# Altium schematic sheet CuC_DataComm.SchDoc: CuC Data Comm
size A4; Author: eldar6776@hotmail.com; DrawnBy: Eldar Dedić; Organization: PROVEN d.o.o.; Address1: Adema Buće 102; Address2: 71000 Sarajevo; Address3: Federacija BiH; Address4: Bosna i Hercegovina; DocumentNumber: DE211213; Revision: 001; SheetNumber: 8; SheetTotal: 15; ProjectName: MIKSER SIROVINE
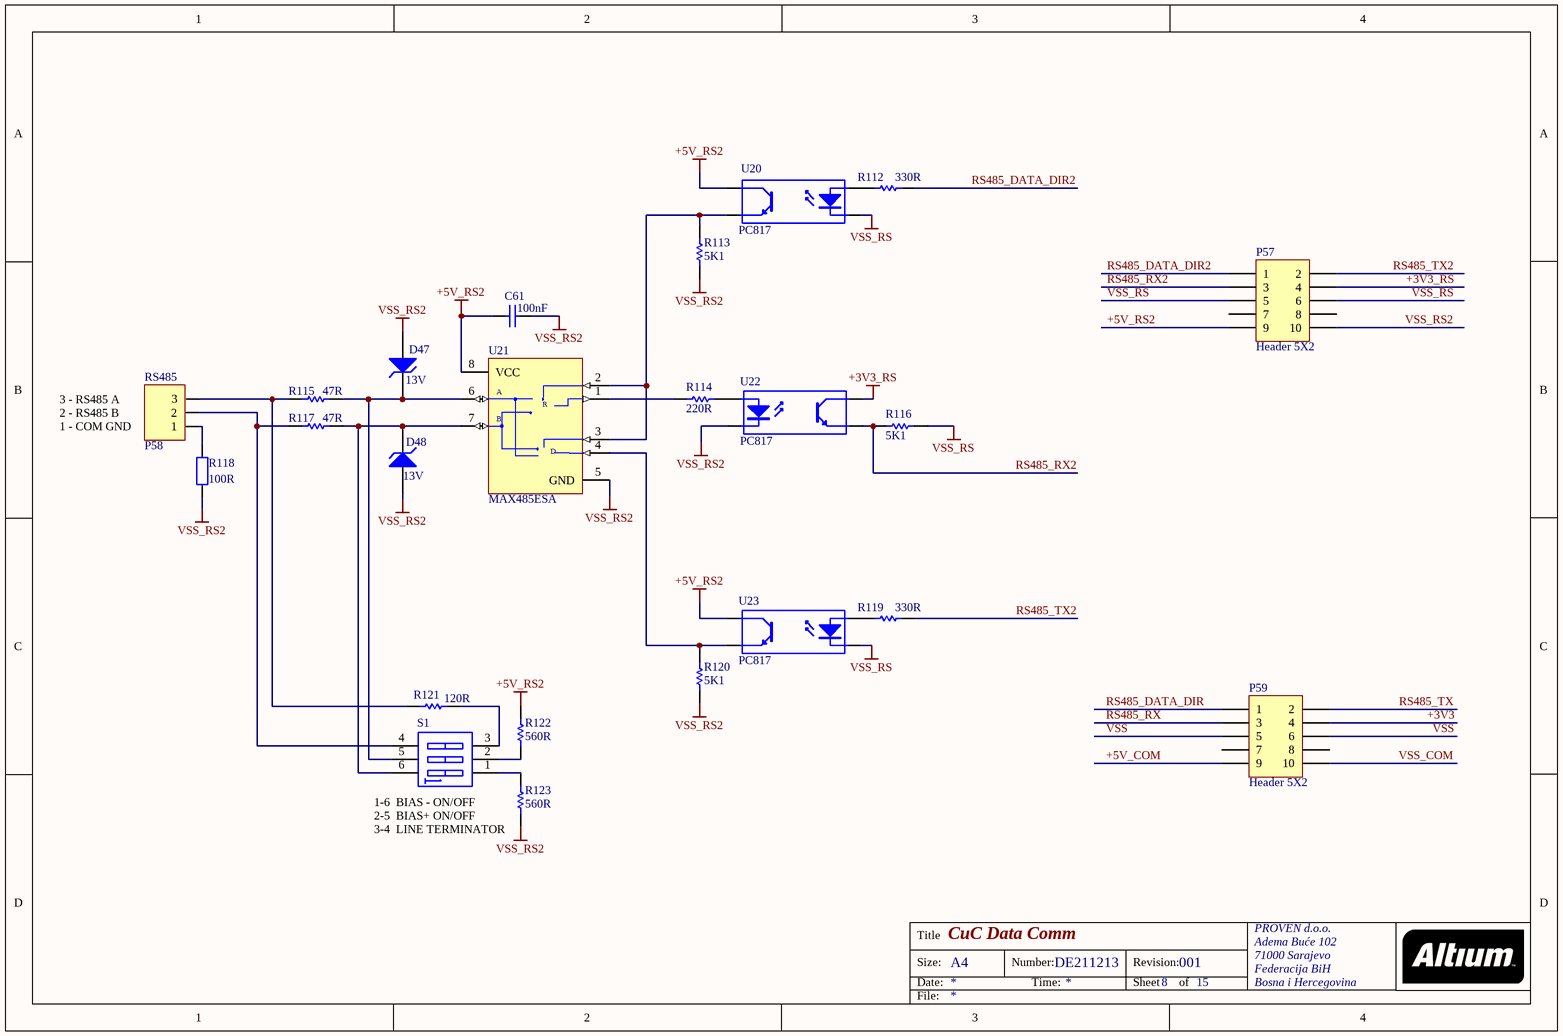
[diagram p0: CuC_DataComm.SchDoc]

## Parts
C61  100nF  [1206]
D47  13V  [DO-35A]
D48  13V  [DO-35A]
P57  Header 5X2  [HDR2X5]
P58  RS485  [TERMINAL BLOK 3]
P59  Header 5X2  [HDR2X5]
R112  330R  [ERA-0805]
R113  5K1  [8-1206]
R114  220R  [ERA-0805]
R115  47R  [ERA-0805]
R116  5K1  [8-1206]
R117  47R  [ERA-0805]
R118  100R  [AXIAL-0.4]
R119  330R  [ERA-0805]
R120  5K1  [8-1206]
R121  120R  [ERA-0805]
R122  560R  [ERA-0805]
R123  560R  [ERA-0805]
S1  (no value)  [DIP-6]
U20  PC817  [DIP-4]
U21  MAX485ESA  [NSO8_N]
U22  PC817  [DIP-4]
U23  PC817  [DIP-4]

## Nets
+3V3_RS: P57.4 U22.4(C)
+5V_RS2: C61.2 P57.9 R122.2 U20.4(C) U21.8(VCC) U23.4(C)
VSS_RS: P57.5 P57.6 R116.2 U20.2(K) U23.2(K)
VSS_RS2: C61.1 D47.1(A) D48.1(A) P57.10 R113.1 R118.1 R120.1 R123.1 U21.5(GND) U22.2(K)
+3V3: P59.4
+5V_COM: P59.9
RS485_DATA_DIR: P59.1
RS485_DATA_DIR2: P57.1 R112.2
RS485_RX: P59.3
RS485_RX2: P57.3 R116.1 U22.3(E)
RS485_TX: P59.2
RS485_TX2: P57.2 R119.2
VSS: P59.5 P59.6
VSS_COM: P59.10
NetD47_2: D47.2(K) R115.2 S1.5(B2) U21.6(A)
NetD48_2: D48.2(K) R117.2 S1.6(B1) U21.7(B)
NetP58_1: P58.1 R118.2
NetP58_2: P58.2 R117.1 S1.4(B3)
NetP58_3: P58.3 R115.1 R121.1
NetR112_1: R112.1 U20.1(A)
NetR113_2: R113.2 U20.3(E) U21.2(~{RE}) U21.3(DE)
NetR114_1: R114.1 U22.1(A)
NetR114_2: R114.2 U21.1(RO)
NetR119_1: R119.1 U23.1(A)
NetR120_2: R120.2 U21.4(DI) U23.3(E)
NetR121_2: R121.2 S1.3(A3)
NetR122_1: R122.1 S1.2(A2)
NetR123_2: R123.2 S1.1(A1)

Not connected (* = marked no-connect by the designer): P57 7 8; P59 7 8

## Notes on the sheet
- 3 - RS485 A
  2 - RS485 B
  1 - COM GND
- (near R123) 1-6  BIAS - ON/OFF
  2-5  BIAS+ ON/OFF
  3-4  LINE TERMINATOR
- Title
- Size:
- Date:
- A4
- Number:
- Time:
- Revision:
- Sheet
- of
- File:
- (in symbol MAX485ESA) R; D

## Library data of the parts
C61 = C1206: Ceramic Chip Capacitor - Standard; Published: 17-Jul-2002; LatestRevisionDate: 19-Mar-2004; LatestRevisionNote: Silkscreen size reduced.; DatasheetDocument: Mar-2001; PackageDocument: Mar-2001; PackageReference: 1206; Publisher: Altium Limited; Code_JEITA: 1206; Code_IPC: 3216 [1206]; ComponentLink1Description: Manufacturer Link; ComponentLink1URL: http://www.kemet.com/; ComponentLink2Description: Datasheet; ComponentLink2URL: http://www.kemet.com/kemet/web/homepage/kechome.nsf/vapubfilesname/F3102TA.pdf/$file/F3102TA.pdf
D47 D48 = D Zener: Zener Diode; Published: 8-Jun-2000; LatestRevisionDate: 17-Jul-2002; LatestRevisionNote: Re-released for DXP Platform.; PackageReference: DIODE-0.7; Publisher: Altium Limited; PackageDescription: Diode, Thru-Hole; 2 Leads; 0.7 in Pin Spacing
P57 P59 = Header 5X2: Header, 5-Pin, Dual row; LatestRevisionDate: 17-Jul-2002; LatestRevisionNote: Re-released for DXP Platform.; Publisher: Altium Limited
P58 = TERMINAL BLOK 3: 3 pinski terminal blok konektor
R112 R119 = ERA6Y: Rectangular Thick Film Chip Resistor, 10 Ohm to 1M Ohm Range, 0.1% and 0.5% Tolerance, 0805 Size, 0.1 W; Note: If flow soldering, adjust pad width of PCB Footprint to 0.7 - 0.8 times the width of the resistor.; Published: 17-Dec-2003; LatestRevisionDate: 19-Mar-2004; LatestRevisionNote: Silkscreen size reduced.; PackageDocument: Mar-2003; PackageReference: ERA-0805; Publisher: Altium Limited; Code_IPC: 2012 [0805]; ComponentLink1Description: Manufacturer Link; ComponentLink1URL: http://www.panasonic.com/industrial/components/resistive_products.htm; ComponentLink2Description: Datasheet; ComponentLink2URL: http://www.panasonic.com/industrial/components/pdf/AOA0000CE8.pdf
R113 R116 R120 = ERJ8GE: Thick Film Chip Resistor, 1 Ohm to 10M Ohm Range, 5% Tolerance, 1206 Size, 0.25 W; Note: If flow soldering, adjust pad width of PCB Footprint to 0.7 - 0.8 times the width of the resistor.; Published: 17-Dec-2003; LatestRevisionDate: 19-Mar-2004; LatestRevisionNote: Silkscreen size reduced.; PackageDocument: Mar-2003; PackageReference: 8-1206; Publisher: Altium Limited; Code_IPC: 3216 [1206]; ComponentLink1Description: Manufacturer Link; ComponentLink1URL: http://www.panasonic.com/industrial/components/resistive_products.htm; ComponentLink2Description: Datasheet; ComponentLink2URL: http://www.panasonic.com/industrial/components/pdf/AOA0000CE1.pdf
R114 R115 R117 R121-R123 = ERAS: Metal Film Thermosensitive Chip Resistor, 0.56 Ohm to 10k Ohm Range, 5% Tolerance, 0805 Size, 0.1 W; Note: If flow soldering, adjust pad width of PCB Footprint to 0.7 - 0.8 times the width of the resistor.; Published: 17-Dec-2003; LatestRevisionDate: 19-Mar-2004; LatestRevisionNote: Silkscreen size reduced.; PackageDocument: Mar-2003; PackageReference: ERA-0805; Publisher: Altium Limited; Code_IPC: 2012 [0805]; ComponentLink1Description: Manufacturer Link; ComponentLink1URL: http://www.panasonic.com/industrial/components/resistive_products.htm; ComponentLink2Description: Datasheet; ComponentLink2URL: http://www.panasonic.com/industrial/components/pdf/AOF0000CE1.pdf
R118 = Res2: Resistor; Published: 8-Jun-2000; LatestRevisionDate: 17-Jul-2002; LatestRevisionNote: Re-released for DXP Platform.; PackageReference: AXIAL-0.4; Publisher: Altium Limited; PackageDescription: Axial Device, Thru-Hole; 2 Leads; 0.4 in Pin Spacing
S1 = SW DIP-3: DIP Switch, 3 Position, SPST; Published: 24-Mar-1999; LatestRevisionDate: 17-Jul-2002; LatestRevisionNote: Re-released for DXP Platform.; PackageReference: DIP-6; Publisher: Altium Limited; Code_JEDEC: MO-001-AM
U20 U22 U23 = Optoisolator1: 4-Pin Phototransistor Optocoupler; Published: 24-Mar-1999; LatestRevisionDate: 04-Mar-2005; LatestRevisionNote: Sch pins 3 & 4 Swapped.; DatasheetVersion: Nov-2003; PackageReference: DIP-4; Publisher: Altium Limited
U21 = MAX485ESA: Low-Power, Slew-Rate-Limited RS-485/RS-422 Transceiver; Published: 16-Jan-2001; LatestRevisionDate: 13-Apr-2006; LatestRevisionNote: IPC-7351 Footprint Added.; DatasheetVersion: Feb-1996; PackageReference: NSO8; Publisher: Altium Limited; PackageDescription: 8-Pin Small Outline Integrated Circuit 1.27 mm Pitch; Code_JEDEC: MS-012-AA; Code_IPC: SOIC127P600-8; ComponentLink1Description: Manufacturer Link; ComponentLink1URL: http://www.maxim-ic.com/; ComponentLink2Description: Datasheet; ComponentLink2URL: http://pdfserv.maxim-ic.com/en/ds/MAX1487-MAX491.pdf